# Altium project MagicArduinoKartya.PrjPcb
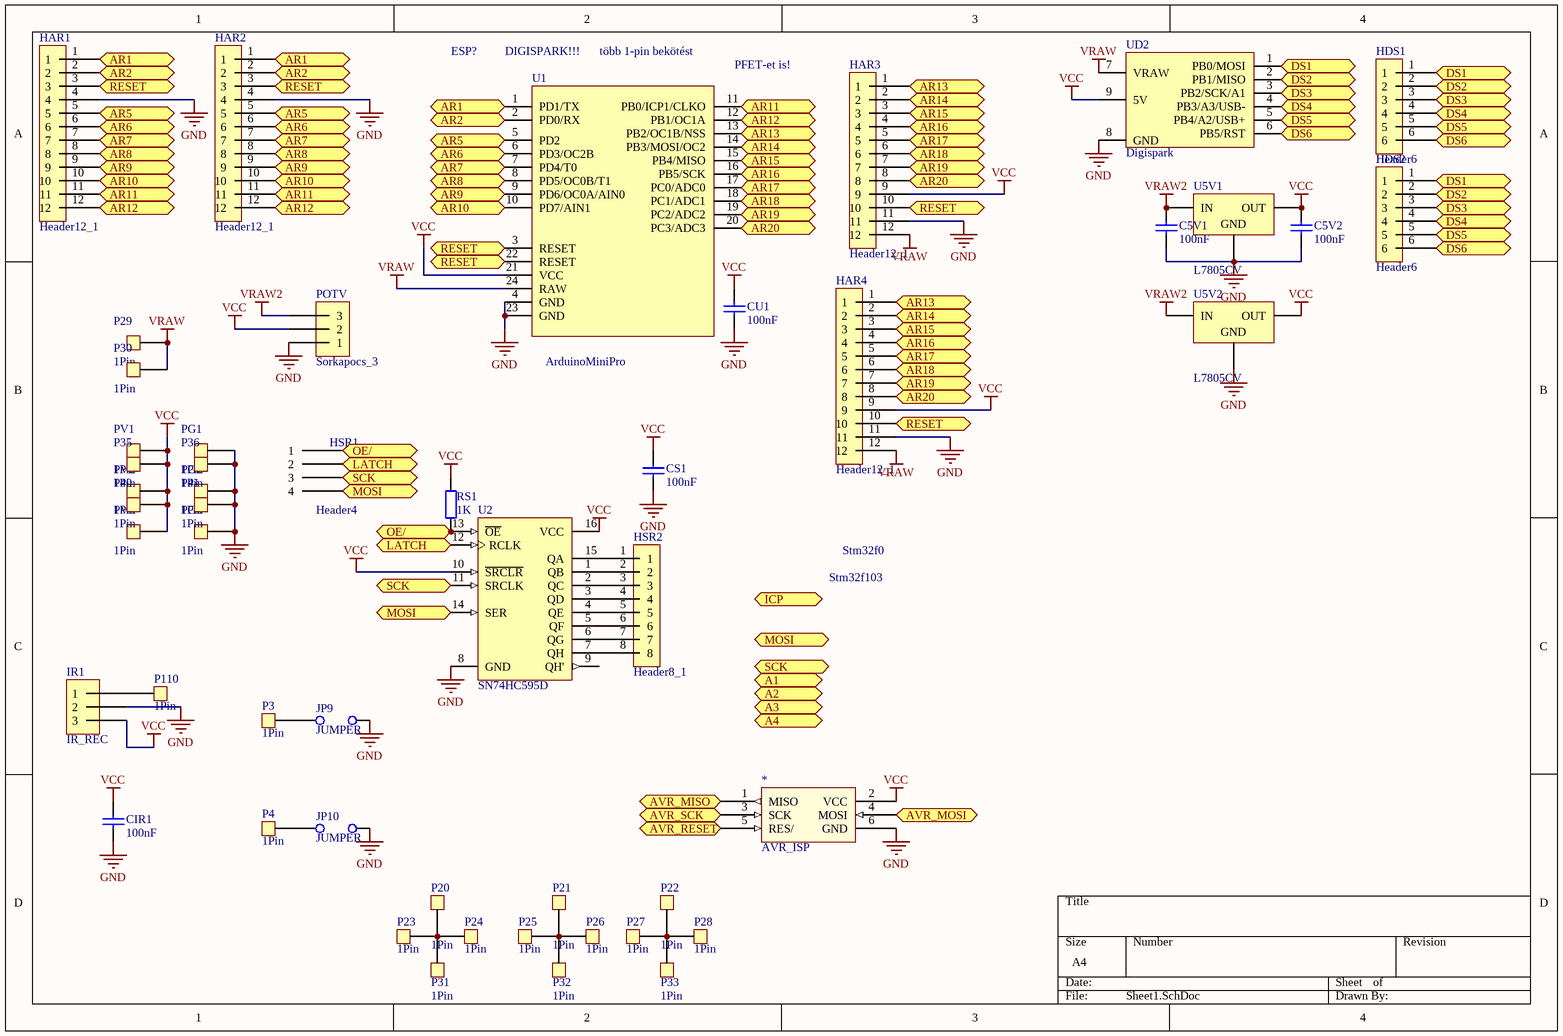
[diagram p0: Sheet1.SchDoc]
3 sheets, 150 parts. Net scope: flat (ports and power ports of the same name join across sheets).
Board file: PCB3.PcbDoc
Sheets:
  Sheet1.SchDoc
  Sheet2.SchDoc
  Sheet3.SchDoc

## Sheet Sheet1.SchDoc
size A4

### Parts
*  AVR_ISP  [HEADER6]
C5V1  100nF  [FP_1206_CAP_125]
C5V2  100nF  [FP_1206_CAP_125]
CIR1  100nF  [FP_0805_CAP_085]
CS1  100nF  [FP_0805_CAP_085]
CU1  100nF  [FP_0805_CAP_085]
HAR1  Header12_1  [HEADER12x1]
HAR2  Header12_1  [HEADER12x1]
HAR3  Header12_1  [HEADER12x1]
HAR4  Header12_1  [HEADER12x1]
HDS1  Header6  [HEADER6x1]
HDS2  Header6  [HEADER6x1]
HSR1  Header4  [FP_CONN4_TUSKE_254MM]
HSR2  Header8_1  [HEADER8x1]
IR1  IR_REC  [FP_CONN3_TUSKE_254MM]
JP9  JUMPER  [FP_CONN2_TUSKE_254MM]
JP10  JUMPER  [FP_CONN2_TUSKE_254MM]
P3  1Pin  [Header1]
P4  1Pin  [Header1]
P20  1Pin  [Header1]
P21  1Pin  [Header1]
P22  1Pin  [Header1]
P23  1Pin  [Header1]
P24  1Pin  [Header1]
P25  1Pin  [Header1]
P26  1Pin  [Header1]
P27  1Pin  [Header1]
P28  1Pin  [Header1]
P29  1Pin  [Header1]
P30  1Pin  [Header1]
P31  1Pin  [Header1]
P32  1Pin  [Header1]
P33  1Pin  [Header1]
P35  1Pin  [Header1]
P36  1Pin  [Header1]
P40  1Pin  [Header1]
P41  1Pin  [Header1]
P110  1Pin  [Header1]
PG1  1Pin  [Header1]
PG2  1Pin  [Header1]
PG3  1Pin  [Header1]
POTV  Sorkapocs_3  [SORKAPOCS_3]
PV1  1Pin  [Header1]
PV2  1Pin  [Header1]
PV3  1Pin  [Header1]
RS1  value 1K  [0805]  (hidden comment: Resistor)
U1  ArduinoMiniPro  [DIP24]
U2  SN74HC595D  [D016_L]
U5V1  L7805CV  [SOT-223]
U5V2  L7805CV  [TO220ABN]
UD2  Digispark  [Digispark]

### Ports
A1, A2, A3, A4, AR1, AR2, AR5, AR6, AR7, AR8, AR9, AR10, AR11, AR12, AR13, AR14, AR15, AR16, AR17, AR18, AR19, AR20, AVR_MISO, AVR_MOSI, AVR_RESET, AVR_SCK, DS1, DS2, DS3, DS4, DS5, DS6, ICP, LATCH, MOSI, OE/, RESET, SCK

### Nets
GND: *.6(GND) C5V1.2 C5V2.2 CIR1.1 CS1.1 CU1.1 HAR1.4 HAR2.4 HAR3.11 HAR4.11 IR1.2 JP9.1(C1) JP10.2(C2) P36.1 P41.1 PG1.1 PG2.1 PG3.1 POTV.1 U1.4(GND) U1.23(GND) U2.8(GND) U5V1.GND U5V2.GND UD2.8(GND)
VCC: *.2(VCC) C5V2.1 CIR1.2 CS1.2 CU1.2 HAR3.9 HAR4.9 IR1.3 P35.1 P40.1 POTV.2 PV1.1 PV2.1 PV3.1 RS1.1 U1.21(VCC) U2.10(~{SRCLR}) U2.16(VCC) U5V1.OUT U5V2.OUT UD2.9(5V)
VRAW: HAR3.12 HAR4.12 P29.1 P30.1 U1.24(RAW) UD2.7(VRAW)
VRAW2: C5V1.1 POTV.3 U5V1.IN U5V2.IN
Net*_1: *.1(MISO) ; port AVR_MISO
Net*_3: *.3(SCK) ; port AVR_SCK
Net*_4: *.4(MOSI) ; port AVR_MOSI
Net*_5: *.5(RES/) ; port AVR_RESET
NetHAR1_1: HAR1.1 HAR2.1 U1.1(PD1/TX) ; port AR1
NetHAR1_2: HAR1.2 HAR2.2 U1.2(PD0/RX) ; port AR2
NetHAR1_3: HAR1.3 HAR2.3 HAR3.10 HAR4.10 U1.3(RESET) U1.22(RESET) ; port RESET
NetHAR1_5: HAR1.5 HAR2.5 U1.5(PD2) ; port AR5
NetHAR1_6: HAR1.6 HAR2.6 U1.6(PD3/OC2B) ; port AR6
NetHAR1_7: HAR1.7 HAR2.7 U1.7(PD4/T0) ; port AR7
NetHAR1_8: HAR1.8 HAR2.8 U1.8(PD5/OC0B/T1) ; port AR8
NetHAR1_9: HAR1.9 HAR2.9 U1.9(PD6/OC0A/AIN0) ; port AR9
NetHAR1_10: HAR1.10 HAR2.10 U1.10(PD7/AIN1) ; port AR10
NetHAR1_11: HAR1.11 HAR2.11 U1.11(PB0/ICP1/CLKO) ; port AR11
NetHAR1_12: HAR1.12 HAR2.12 U1.12(PB1/OC1A) ; port AR12
NetHAR3_1: HAR3.1 HAR4.1 U1.13(PB2/OC1B/NSS) ; port AR13
NetHAR3_2: HAR3.2 HAR4.2 U1.14(PB3/MOSI/OC2) ; port AR14
NetHAR3_3: HAR3.3 HAR4.3 U1.15(PB4/MISO) ; port AR15
NetHAR3_4: HAR3.4 HAR4.4 U1.16(PB5/SCK) ; port AR16
NetHAR3_5: HAR3.5 HAR4.5 U1.17(PC0/ADC0) ; port AR17
NetHAR3_6: HAR3.6 HAR4.6 U1.18(PC1/ADC1) ; port AR18
NetHAR3_7: HAR3.7 HAR4.7 U1.19(PC2/ADC2) ; port AR19
NetHAR3_8: HAR3.8 HAR4.8 U1.20(PC3/ADC3) ; port AR20
NetHDS1_1: HDS1.1 HDS2.1 UD2.1(PB0/MOSI) ; port DS1
NetHDS1_2: HDS1.2 HDS2.2 UD2.2(PB1/MISO) ; port DS2
NetHDS1_3: HDS1.3 HDS2.3 UD2.3(PB2/SCK/A1) ; port DS3
NetHDS1_4: HDS1.4 HDS2.4 UD2.4(PB3/A3/USB-) ; port DS4
NetHDS1_5: HDS1.5 HDS2.5 UD2.5(PB4/A2/USB+) ; port DS5
NetHDS1_6: HDS1.6 HDS2.6 UD2.6(PB5/RST) ; port DS6
NetHSR1_1: HSR1.1 RS1.2 U2.13(~{OE}) ; port OE/
NetHSR1_2: HSR1.2 U2.12(RCLK) ; port LATCH
NetHSR1_3: HSR1.3 U2.11(SRCLK) ; port SCK
NetHSR1_4: HSR1.4 U2.14(SER) ; port MOSI
NetHSR2_1: HSR2.1 U2.15(QA)
NetHSR2_2: HSR2.2 U2.1(QB)
NetHSR2_3: HSR2.3 U2.2(QC)
NetHSR2_4: HSR2.4 U2.3(QD)
NetHSR2_5: HSR2.5 U2.4(QE)
NetHSR2_6: HSR2.6 U2.5(QF)
NetHSR2_7: HSR2.7 U2.6(QG)
NetHSR2_8: HSR2.8 U2.7(QH)
NetIR1_1: IR1.1 P110.1
NetJP9_2: JP9.2(C2) P3.1
NetJP10_1: JP10.1(C1) P4.1
NetP20_1: P20.1 P23.1 P24.1 P31.1
NetP21_1: P21.1 P25.1 P26.1 P32.1
NetP22_1: P22.1 P27.1 P28.1 P33.1

Not connected (* = marked no-connect by the designer): U2 9(QH')

### Notes on the sheet
- ESP?
- (near U1) DIGISPARK!!!
- (near U1) több 1-pin bekötést
- (near U1) PFET-et is!
- Stm32f103
- Stm32f0

### Library data of the parts
C5V1 C5V2 CIR1 CS1 CU1 = CAP: Capacitor; Value: 100nF
IR1 = Sorkapocs_3
JP9 JP10 = JUMPER: Jumper Wire; Supplier: Farnell 1668537×1/6
U2 = SN74HC595D: 8-Bit Shift Register with 3-State Output Registers; Published: 8-Jun-2000; LatestRevisionDate: 13-Apr-2006; LatestRevisionNote: IPC-7351 Footprint Added.; DatasheetVersion: May-1997; PackageVersion: Jan-1998; PackageReference: D016; Publisher: Altium Limited; PackageDescription: 16-Pin Small Outline Integrated Circuit 1.27 mm Pitch; Code_IPC: SOIC127P600-16; ComponentLink1Description: Manufacturer Link; ComponentLink1URL: http://www.ti.com/; ComponentLink2Description: Datasheet; ComponentLink2URL: http://www-s.ti.com/sc/ds/sn74hc595.pdf
U5V1 = L7805CV: Positive Voltage Regulator; pin to pad: GND>1 IN>3 OUT>2; Note: Tab is connected to pin 3 (GND).; Published: 24-Aug-2001; LatestRevisionDate: 17-Jul-2002; LatestRevisionNote: Re-released for DXP Platform.; DatasheetVersion: Dec-1998; PackageVersion: Jun-1998; PackageReference: TO220ABN; Publisher: Altium Limited; PackageDescription: TO, Thru-Hole, Vertical, Heatsink Mounted; 3 In-Line Leads; Pitch 2.54 mm; Pin sequence 1, 3, 2; ComponentLink1Description: Manufacturer Link; ComponentLink1URL: http://www.st.com/
U5V2 = L7805CV: Positive Voltage Regulator; pin to pad: GND>3 IN>1 OUT>2; Note: Tab is connected to pin 3 (GND).; Published: 24-Aug-2001; LatestRevisionDate: 17-Jul-2002; LatestRevisionNote: Re-released for DXP Platform.; DatasheetVersion: Dec-1998; PackageVersion: Jun-1998; PackageReference: TO220ABN; Publisher: Altium Limited; PackageDescription: TO, Thru-Hole, Vertical, Heatsink Mounted; 3 In-Line Leads; Pitch 2.54 mm; Pin sequence 1, 3, 2; ComponentLink1Description: Manufacturer Link; ComponentLink1URL: http://www.st.com/
RS1 = Resistor: Published: 8-Jun-2000; LatestRevisionDate: 17-Jul-2002; LatestRevisionNote: Re-released for DXP Platform.; PackageReference: AXIAL-0.4; Publisher: Altium Limited

## Sheet Sheet2.SchDoc
size A4
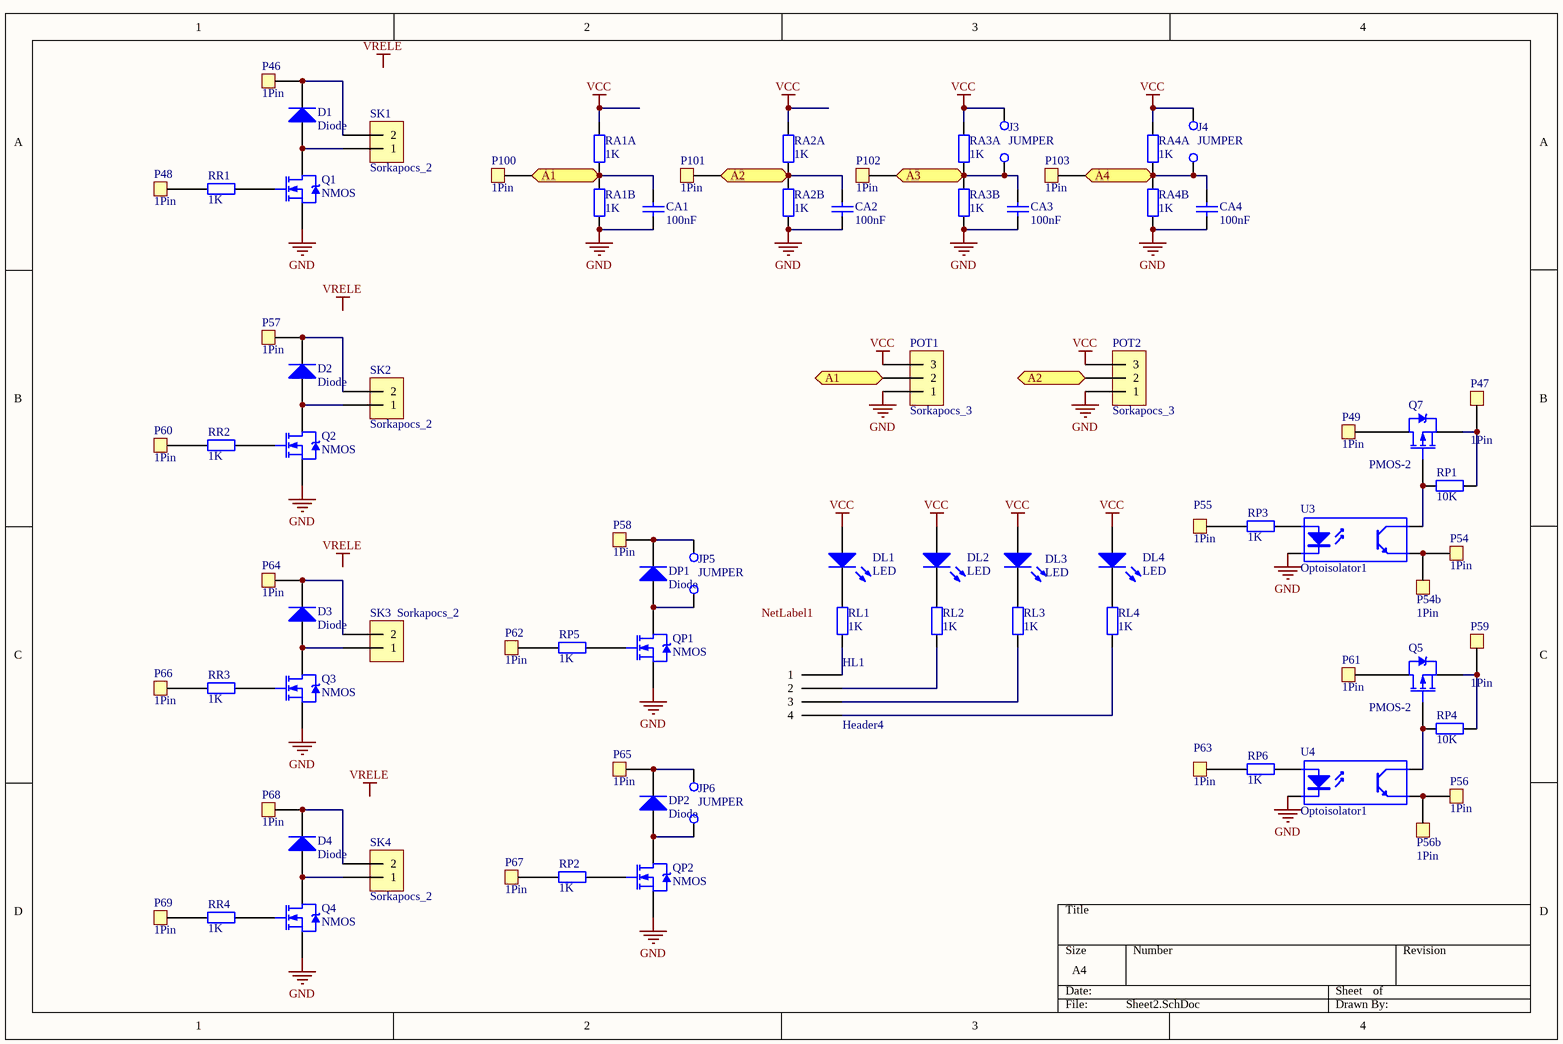
[diagram p1: Sheet2.SchDoc]

### Parts
CA1  100nF  [FP_0805_CAP_085]
CA2  100nF  [FP_0805_CAP_085]
CA3  100nF  [FP_0805_CAP_085]
CA4  100nF  [FP_0805_CAP_085]
D1  Diode  [DO214]
D2  Diode  [DO214]
D3  Diode  [DO214]
D4  Diode  [DO214]
DL1  LED  [FP_0805_LED_RED]
DL2  LED  [FP_0805_LED_RED]
DL3  LED  [FP_0805_LED_RED]
DL4  LED  [FP_0805_LED_RED]
DP1  Diode  [DO214]
DP2  Diode  [DO214]
HL1  Header4  [FP_CONN4_TUSKE_254MM]
J3  JUMPER  [FP_CONN2_TUSKE_254MM]
J4  JUMPER  [FP_CONN2_TUSKE_254MM]
JP5  JUMPER  [FP_CONN2_TUSKE_254MM]
JP6  JUMPER  [FP_CONN2_TUSKE_254MM]
P46  1Pin  [Header1]
P47  1Pin  [Header1]
P48  1Pin  [Header1]
P49  1Pin  [Header1]
P54  1Pin  [Header1]
P54b  1Pin  [Header1]
P55  1Pin  [Header1]
P56  1Pin  [Header1]
P56b  1Pin  [Header1]
P57  1Pin  [Header1]
P58  1Pin  [Header1]
P59  1Pin  [Header1]
P60  1Pin  [Header1]
P61  1Pin  [Header1]
P62  1Pin  [Header1]
P63  1Pin  [Header1]
P64  1Pin  [Header1]
P65  1Pin  [Header1]
P66  1Pin  [Header1]
P67  1Pin  [Header1]
P68  1Pin  [Header1]
P69  1Pin  [Header1]
P100  1Pin  [Header1]
P101  1Pin  [Header1]
P102  1Pin  [Header1]
P103  1Pin  [Header1]
POT1  Sorkapocs_3  [SORKAPOCS_3]
POT2  Sorkapocs_3  [SORKAPOCS_3]
Q1  NMOS  [SOT95P245X110-3N]
Q2  NMOS  [SOT95P245X110-3N]
Q3  NMOS  [SOT95P245X110-3N]
Q4  NMOS  [SOT95P245X110-3N]
Q5  PMOS-2  [SOT95P245X110-3N]
Q7  PMOS-2  [SOT95P245X110-3N]
QP1  NMOS  [SOT95P245X110-3N]
QP2  NMOS  [SOT95P245X110-3N]
RA1A  value 1K  [0805]  (hidden comment: Resistor)
RA1B  value 1K  [0805]  (hidden comment: Resistor)
RA2A  value 1K  [0805]  (hidden comment: Resistor)
RA2B  value 1K  [0805]  (hidden comment: Resistor)
RA3A  value 1K  [0805]  (hidden comment: Resistor)
RA3B  value 1K  [0805]  (hidden comment: Resistor)
RA4A  value 1K  [0805]  (hidden comment: Resistor)
RA4B  value 1K  [0805]  (hidden comment: Resistor)
RL1  value 1K  [0805]  (hidden comment: Resistor)
RL2  value 1K  [0805]  (hidden comment: Resistor)
RL3  value 1K  [0805]  (hidden comment: Resistor)
RL4  value 1K  [0805]  (hidden comment: Resistor)
RP1  value 10K  [0805]  (hidden comment: Resistor)
RP2  value 1K  [0805]  (hidden comment: Resistor)
RP3  value 1K  [0805]  (hidden comment: Resistor)
RP4  value 10K  [0805]  (hidden comment: Resistor)
RP5  value 1K  [0805]  (hidden comment: Resistor)
RP6  value 1K  [0805]  (hidden comment: Resistor)
RR1  value 1K  [0805]  (hidden comment: Resistor)
RR2  value 1K  [0805]  (hidden comment: Resistor)
RR3  value 1K  [0805]  (hidden comment: Resistor)
RR4  value 1K  [0805]  (hidden comment: Resistor)
SK1  Sorkapocs_2  [SORKAPOCS_2]
SK2  Sorkapocs_2  [SORKAPOCS_2]
SK3  Sorkapocs_2  [SORKAPOCS_2]
SK4  Sorkapocs_2  [SORKAPOCS_2]
U3  Optoisolator1  [DIP-4]
U4  Optoisolator1  [DIP-4]

### Ports
A1, A2, A3, A4

### Nets
GND: CA1.1 CA2.1 CA3.1 CA4.1 POT1.1 POT2.1 Q1.S Q2.S Q3.S Q4.S QP1.S QP2.S RA1B.1 RA2B.1 RA3B.1 RA4B.1 U3.2(K) U4.2(K)
VCC: DL1.1(A) DL2.1(A) DL3.1(A) DL4.1(A) J3.2(C2) J4.2(C2) POT1.3 POT2.3 RA1A.2 RA2A.2 RA3A.2 RA4A.2
NetCA1_2: CA1.2 P100.1 POT1.2 RA1A.1 RA1B.2 ; port A1
NetCA2_2: CA2.2 P101.1 POT2.2 RA2A.1 RA2B.2 ; port A2
NetCA3_2: CA3.2 J3.1(C1) P102.1 RA3A.1 RA3B.2 ; port A3
NetCA4_2: CA4.2 J4.1(C1) P103.1 RA4A.1 RA4B.2 ; port A4
NetD1_1: D1.1(A) Q1.D SK1.1
NetD1_2: D1.2(K) P46.1 SK1.2
NetD2_1: D2.1(A) Q2.D SK2.1
NetD2_2: D2.2(K) P57.1 SK2.2
NetD3_1: D3.1(A) Q3.D SK3.1
NetD3_2: D3.2(K) P64.1 SK3.2
NetD4_1: D4.1(A) Q4.D SK4.1
NetD4_2: D4.2(K) P68.1 SK4.2
NetDL1_2: DL1.2(K) RL1.2
NetDL2_2: DL2.2(K) RL2.2
NetDL3_2: DL3.2(K) RL3.2
NetDL4_2: DL4.2(K) RL4.2
NetDP1_1: DP1.1(A) JP5.1(C1) QP1.D
NetDP1_2: DP1.2(K) JP5.2(C2) P58.1
NetDP2_1: DP2.1(A) JP6.1(C1) QP2.D
NetDP2_2: DP2.2(K) JP6.2(C2) P65.1
NetHL1_1: HL1.1 RL1.1
NetHL1_2: HL1.2 RL2.1
NetHL1_3: HL1.3 RL3.1
NetHL1_4: HL1.4 RL4.1
NetP47_1: P47.1 Q7.S RP1.1
NetP48_1: P48.1 RR1.2
NetP49_1: P49.1 Q7.D
NetP54_1: P54.1 P54b.1 U3.3(E)
NetP55_1: P55.1 RP3.2
NetP56_1: P56.1 P56b.1 U4.3(E)
NetP59_1: P59.1 Q5.S RP4.1
NetP60_1: P60.1 RR2.2
NetP61_1: P61.1 Q5.D
NetP62_1: P62.1 RP5.2
NetP63_1: P63.1 RP6.2
NetP66_1: P66.1 RR3.2
NetP67_1: P67.1 RP2.2
NetP69_1: P69.1 RR4.2
NetQ1_G: Q1.G RR1.1
NetQ2_G: Q2.G RR2.1
NetQ3_G: Q3.G RR3.1
NetQ4_G: Q4.G RR4.1
NetQ5_G: Q5.G RP4.2 U4.4(C)
NetQ7_G: Q7.G RP1.2 U3.4(C)
NetQP1_G: QP1.G RP5.1
NetQP2_G: QP2.G RP2.1
NetRP3_1: RP3.1 U3.1(A)
NetRP6_1: RP6.1 U4.1(A)

### Notes on the sheet
- Labels drawn without touching a wire or pin: NetLabel1, VRELE

### Library data of the parts
CA1-CA4 = CAP: Capacitor; Value: 100nF
DL1-DL4 = LED: Typical RED GaAs LED; pin to pad: 1>A 2>K
J3 J4 JP5 JP6 = JUMPER: Jumper Wire; Supplier: Farnell 1668537×1/6
Q1-Q4 QP1 QP2 = NMOS: N-Channel Power MOSFET; pin to pad: D>3 G>1 S>2; Note: Pin 2 is electrically connected to pin 4.; Published: 8-Jun-2000; LatestRevisionDate: 17-Jul-2002; LatestRevisionNote: Re-released for DXP Platform.; DatasheetDocument: PD-9.814; PackageReference: TO-220AB; Publisher: Altium Limited; Code_JEDEC: TO-220-AB; ComponentLink1Description: Manufacturer Link; ComponentLink1URL: http://www.irf.com/
Q5 Q7 = PMOS-2: P-Channel Power MOSFET; pin to pad: D>3 G>1 S>2; Note: Pin 4 not drawn and electrically connected to Pin 2.; Published: 8-Jun-2000; LatestRevisionDate: 17-Jul-2002; LatestRevisionNote: Re-released for DXP Platform.; DatasheetVersion: PD-9.390D; PackageVersion: Feb-1997; PackageReference: TO-220AB; Publisher: Altium Limited; PackageDescription: TO, Thru-Hole, Vertical, Heatsink Mounted; 3 In-Line Leads; Pitch 2.54 mm; ComponentLink1Description: Manufacturer Link; ComponentLink1URL: http://www.irf.com/
U3 U4 = Optoisolator1: 4-Pin Phototransistor Optocoupler; Published: 24-Mar-1999; LatestRevisionDate: 04-Mar-2005; LatestRevisionNote: Sch pins 3 & 4 Swapped.; DatasheetVersion: Nov-2003; PackageReference: DIP-4; Publisher: Altium Limited
D1-D4 DP1 DP2 = Diode: Published: 8-Jun-2000; LatestRevisionDate: 17-Jul-2002; LatestRevisionNote: Re-released for DXP Platform.; DatasheetDocument: 6-Aug-1999; PackageReference: DO-35; Publisher: Altium Limited; Code_JEDEC: DO-204-AH; ComponentLink1Description: Manufacturer Link; ComponentLink1URL: http://www.vishay.com/; ComponentLink2Description: Datasheet; ComponentLink2URL: http://www.vishay.com/docs/85588/85588.pdf
RA1A RA1B RA2A RA2B RA3A RA3B RA4A RA4B RL1-RL4 RP1-RP6 RR1-RR4 = Resistor: Published: 8-Jun-2000; LatestRevisionDate: 17-Jul-2002; LatestRevisionNote: Re-released for DXP Platform.; PackageReference: AXIAL-0.4; Publisher: Altium Limited

## Sheet Sheet3.SchDoc
size A4
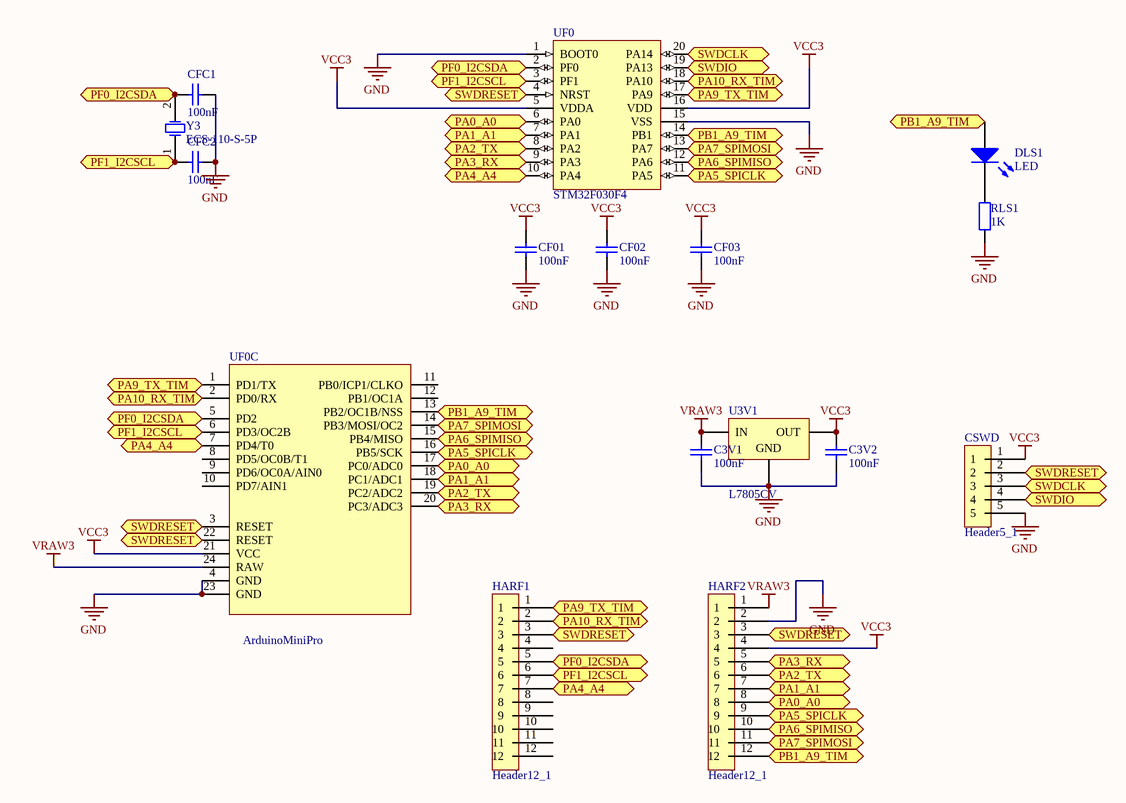
[diagram p2: Sheet3.SchDoc]

### Parts
C3V1  100nF  [FP_1206_CAP_125]
C3V2  100nF  [FP_1206_CAP_125]
CF01  100nF  [FP_0805_CAP_085]
CF02  100nF  [FP_0805_CAP_085]
CF03  100nF  [FP_0805_CAP_085]
CFC1  100nF  [FP_0805_CAP_085]
CFC2  100nF  [FP_0805_CAP_085]
CSWD  Header5_1  [HEADER5x1]
DLS1  LED  [FP_0805_LED_RED]
HARF1  Header12_1  [HEADER12x1]
HARF2  Header12_1  [HEADER12x1]
RLS1  value 1K  [0805]  (hidden comment: Resistor)
U3V1  L7805CV  [SOT-223]
UF0  STM32F030F4  [TSSOP20]
UF0C  ArduinoMiniPro  [DIP24]
Y3  ECS-110-S-5P  [Crystal]

### Ports
PA0_A0, PA1_A1, PA2_TX, PA3_RX, PA4_A4, PA5_SPICLK, PA6_SPIMISO, PA7_SPIMOSI, PA9_TX_TIM, PA10_RX_TIM, PB1_A9_TIM, PF0_I2CSDA, PF1_I2CSCL, SWDCLK, SWDIO, SWDRESET

### Nets
GND: C3V1.2 C3V2.2 CF01.1 CF02.1 CF03.1 CFC1.2 CFC2.2 CSWD.5 HARF2.2 RLS1.1 U3V1.GND UF0.1(BOOT0) UF0.15(VSS) UF0C.4(GND) UF0C.23(GND)
VCC3: C3V2.1 CF01.2 CF02.2 CF03.2 CSWD.1 HARF2.4 U3V1.OUT UF0.5(VDDA) UF0.16(VDD) UF0C.21(VCC)
VRAW3: C3V1.1 HARF2.1 U3V1.IN UF0C.24(RAW)
NetCFC1_1: CFC1.1 HARF1.5 UF0.2(PF0) UF0C.5(PD2) Y3.2(OSC2) ; port PF0_I2CSDA
NetCFC2_1: CFC2.1 HARF1.6 UF0.3(PF1) UF0C.6(PD3/OC2B) Y3.1(OSC1) ; port PF1_I2CSCL
NetCSWD_2: CSWD.2 HARF1.3 HARF2.3 UF0.4(NRST) UF0C.3(RESET) UF0C.22(RESET) ; port SWDRESET
NetCSWD_3: CSWD.3 UF0.20(PA14) ; port SWDCLK
NetCSWD_4: CSWD.4 UF0.19(PA13) ; port SWDIO
NetDLS1_1: DLS1.1(A) HARF2.12 UF0.14(PB1) UF0C.13(PB2/OC1B/NSS) ; port PB1_A9_TIM
NetDLS1_2: DLS1.2(K) RLS1.2
NetHARF1_1: HARF1.1 UF0.17(PA9) UF0C.1(PD1/TX) ; port PA9_TX_TIM
NetHARF1_2: HARF1.2 UF0.18(PA10) UF0C.2(PD0/RX) ; port PA10_RX_TIM
NetHARF1_7: HARF1.7 UF0.10(PA4) UF0C.7(PD4/T0) ; port PA4_A4
NetHARF2_5: HARF2.5 UF0.9(PA3) UF0C.20(PC3/ADC3) ; port PA3_RX
NetHARF2_6: HARF2.6 UF0.8(PA2) UF0C.19(PC2/ADC2) ; port PA2_TX
NetHARF2_7: HARF2.7 UF0.7(PA1) UF0C.18(PC1/ADC1) ; port PA1_A1
NetHARF2_8: HARF2.8 UF0.6(PA0) UF0C.17(PC0/ADC0) ; port PA0_A0
NetHARF2_9: HARF2.9 UF0.11(PA5) UF0C.16(PB5/SCK) ; port PA5_SPICLK
NetHARF2_10: HARF2.10 UF0.12(PA6) UF0C.15(PB4/MISO) ; port PA6_SPIMISO
NetHARF2_11: HARF2.11 UF0.13(PA7) UF0C.14(PB3/MOSI/OC2) ; port PA7_SPIMOSI

Not connected (* = marked no-connect by the designer): HARF1 4 8 9 10 11 12; UF0C 8(PD5/OC0B/T1) 9(PD6/OC0A/AIN0) 10(PD7/AIN1) 11(PB0/ICP1/CLKO) 12(PB1/OC1A)

### Library data of the parts
C3V1 C3V2 CF01 CF02 CF03 CFC1 CFC2 = CAP: Capacitor; Value: 100nF
DLS1 = LED: Typical RED GaAs LED; pin to pad: 1>A 2>K
U3V1 = L7805CV: Positive Voltage Regulator; pin to pad: GND>1 IN>3 OUT>2; Note: Tab is connected to pin 3 (GND).; Published: 24-Aug-2001; LatestRevisionDate: 17-Jul-2002; LatestRevisionNote: Re-released for DXP Platform.; DatasheetVersion: Dec-1998; PackageVersion: Jun-1998; PackageReference: TO220ABN; Publisher: Altium Limited; PackageDescription: TO, Thru-Hole, Vertical, Heatsink Mounted; 3 In-Line Leads; Pitch 2.54 mm; Pin sequence 1, 3, 2; ComponentLink1Description: Manufacturer Link; ComponentLink1URL: http://www.st.com/
UF0 = STM32F030F4: STMICROELECTRONICS  STM32F030F4P6  MCU, 32BIT, CORTEX-M0, 48MHZ
Y3 = ECS-110-S-5P: Crystal Oscillator; Published: 17-Jul-2002; DatasheetDocument: 18-Apr-2000; PackageReference: CSM-7; Publisher: Altium Limited; ComponentLink1Description: Manufacturer Link; ComponentLink1URL: http://www.ecsxtal.com/; ComponentLink2Description: Datasheet; ComponentLink2URL: http://www.ecsxtal.com/pdf3/CSM_7.pdf
RLS1 = Resistor: Published: 8-Jun-2000; LatestRevisionDate: 17-Jul-2002; LatestRevisionNote: Re-released for DXP Platform.; PackageReference: AXIAL-0.4; Publisher: Altium Limited

## Nets that join several sheets
GND: Sheet1 (25 pins), Sheet2 (18 pins), Sheet3 (15 pins)
VCC: Sheet1 (21 pins), Sheet2 (12 pins)